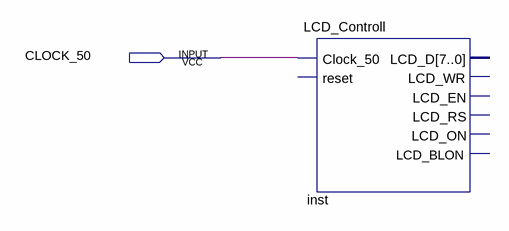
[diagram p0: schematic sheet]
// Quartus schematic Main.bdf as structural Verilog: 1 symbols, 1 pins
module Main (
  input  CLOCK_50
);

  LCD_Controll inst (.Clock_50(CLOCK_50));  // open: reset, LCD_D, LCD_WR, LCD_EN, LCD_RS, LCD_ON, LCD_BLON
endmodule
